# Altium schematic sheet ISM4319.SchDoc
size A
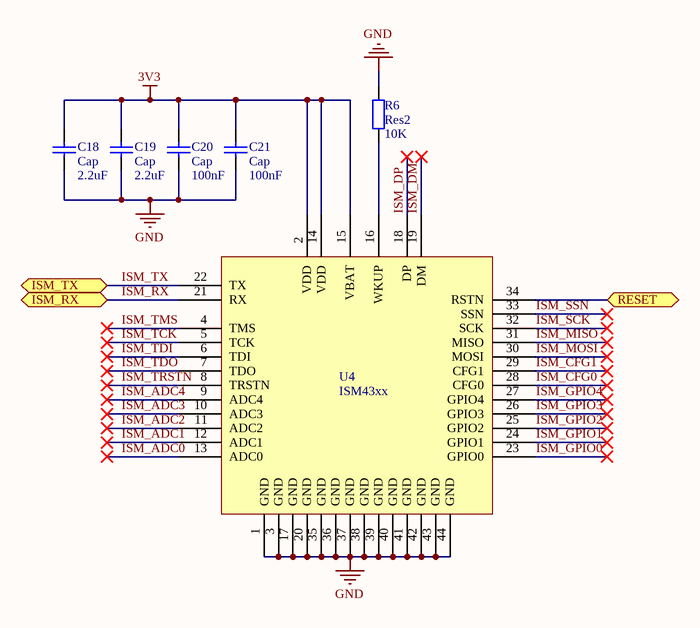
[diagram p0: ISM4319.SchDoc]

## Parts
C18  Cap  value 2.2uF  [0603]
C19  Cap  value 2.2uF  [0603]
C20  Cap  value 100nF  [0603]
C21  Cap  value 100nF  [0603]
R6  Res2  value 10K  [0603]
U4  ISM43xx  [ISM-WIFI]

## Ports
ISM_RX, ISM_TX, RESET

## Nets
3V3: C18.2 C19.2 C20.2 C21.2 U4.2(VDD) U4.14(VDD) U4.15(VBAT)
GND: C18.1 C19.1 C20.1 C21.1 R6.2 U4.1(GND) U4.3(GND) U4.17(GND) U4.20(GND) U4.35(GND) U4.36(GND) U4.37(GND) U4.38(GND) U4.39(GND) U4.40(GND) U4.41(GND) U4.42(GND) U4.43(GND) U4.44(GND)
ISM_ADC0: U4.13(ADC0)
ISM_ADC1: U4.12(ADC1)
ISM_ADC2: U4.11(ADC2)
ISM_ADC3: U4.10(ADC3)
ISM_ADC4: U4.9(ADC4)
ISM_CFG0: U4.28(CFG0)
ISM_CFG1: U4.29(CFG1)
ISM_DM: U4.19(DM)
ISM_DP: U4.18(DP)
ISM_GPIO0: U4.23(GPIO0)
ISM_GPIO1: U4.24(GPIO1)
ISM_GPIO2: U4.25(GPIO2)
ISM_GPIO3: U4.26(GPIO3)
ISM_GPIO4: U4.27(GPIO4)
ISM_MISO: U4.31(MISO)
ISM_MOSI: U4.30(MOSI)
ISM_RX: U4.21(RX) ; port ISM_RX
ISM_SCK: U4.32(SCK)
ISM_SSN: U4.33(SSN)
ISM_TCK: U4.5(TCK)
ISM_TDI: U4.6(TDI)
ISM_TDO: U4.7(TDO)
ISM_TMS: U4.4(TMS)
ISM_TRSTN: U4.8(TRSTN)
ISM_TX: U4.22(TX) ; port ISM_TX
RESET: U4.34(RSTN) ; port RESET
NetR6_1: R6.1 U4.16(WKUP)

## Library data of the parts
C18-C21 = Cap: Capacitor; Supplier 1: Digi-Key
  C18 C19: Supplier Part Number 1: 587-2983-1-ND
  C20 C21: Supplier Part Number 1: 399-1095-1-ND
R6 = Res2: Resistor; Supplier 1: Digi-Key; Supplier Part Number 1: 311-10KGRCT-ND
U4 = ISM4319: Inventek Systems WiFi Module